# EAGLE design LaserPointerRemote (EAGLE 6.5.0)
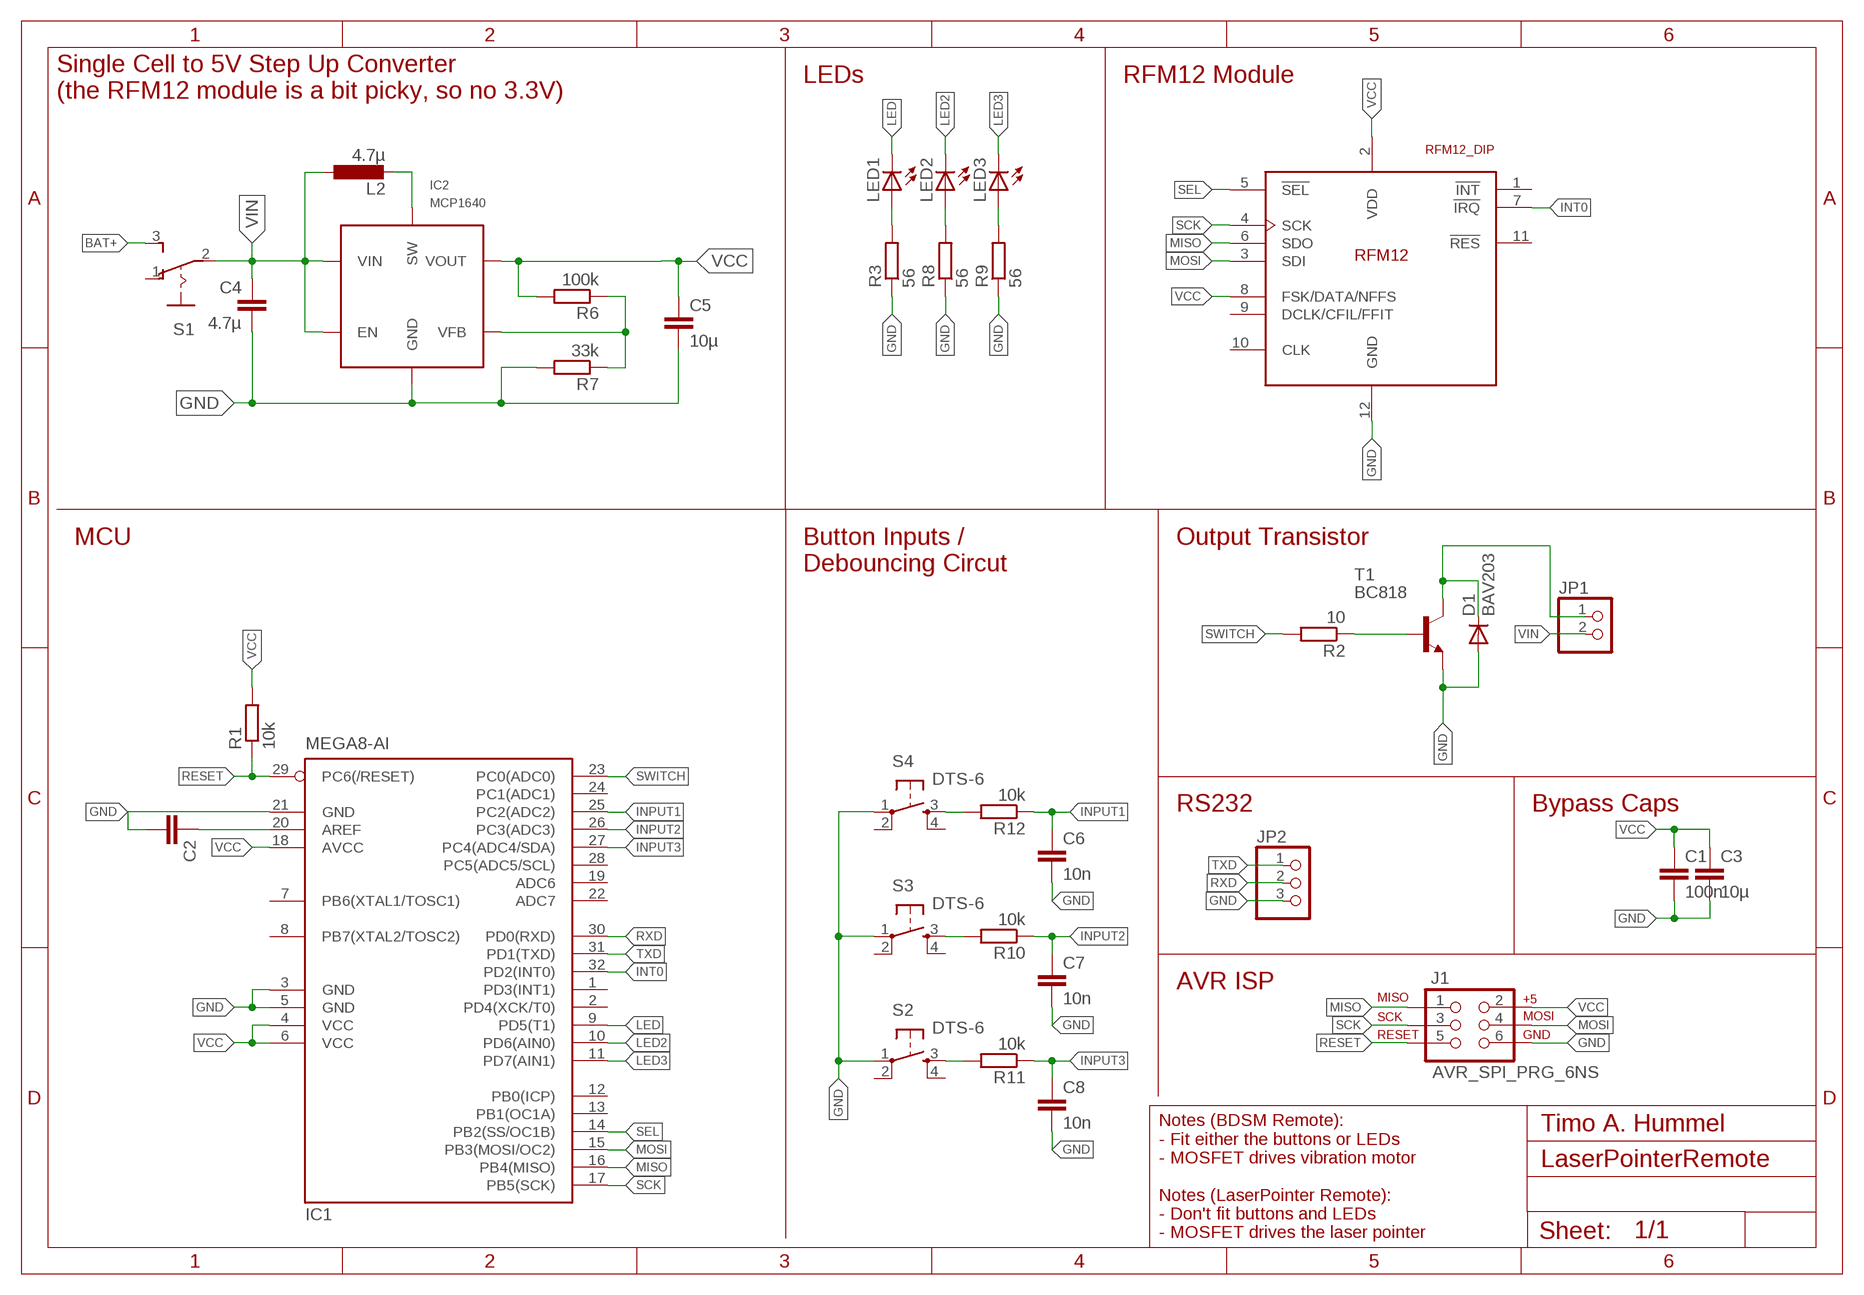
[diagram p0: schematic, sheet 1]

## Parts
C1  100n  C-EUC0805  [C0805]
C2  C-EUC0805  [C0805]
C3  10µ  C-EUC0805  [C0805]
C4  4.7µ  C-EUC0805  [C0805]
C5  10µ  C-EUC0805  [C0805]
C6  10n  C-EUC0805  [C0805]
C7  10n  C-EUC0805  [C0805]
C8  10n  C-EUC0805  [C0805]
D1  BAV203  DIODE-SOD80C  [SOD80C]
IC1  MEGA8-AI  [TQFP32-08]
IC2  MCP1640  [SOT23-6]
J1  AVR_SPI_PRG_6NS  [2X3-NS]
JP1  PINHD-1X2  [1X02]
JP2  PINHD-1X3  [1X03]
L2  4.7µ  L-EUPISG  [PISG]
LED1  LED3MM  [LED3MM]
LED2  LED3MM  [LED3MM]
LED3  LED3MM  [LED3MM]
R1  10k  R-EU_R0805  [R0805]
R2  10  R-EU_R0805  [R0805]
R3  56  R-EU_R0805  [R0805]
R6  100k  R-EU_R0805  [R0805]
R7  33k  R-EU_R0805  [R0805]
R8  56  R-EU_R0805  [R0805]
R9  56  R-EU_R0805  [R0805]
R10  10k  R-EU_R0805  [R0805]
R11  10k  R-EU_R0805  [R0805]
R12  10k  R-EU_R0805  [R0805]
S1  SS12  [NKKSS-12]
S2  DTS-6  [DTS-6]
S3  DTS-6  [DTS-6]
S4  DTS-6  [DTS-6]
T1  BC818  BC818-16-NPN-SOT23-BEC  [SOT23-BEC]
U$1  RFM12_DIP  [DIL-2MM-2X06]

## Nets
BAT+: S1.3(S)
GND: C1.2 C2.2 C3.2 C4.2 C5.2 C6.2 C7.2 C8.2 D1.A IC1.3(GND) IC1.5(GND) IC1.21(GND) IC2.2(GND) J1.6 JP2.3 R3.1 R7.2 R8.1 R9.1 S2.1 S3.1 S4.1 T1.E U$1.12(GND)
INPUT1: C6.1 IC1.25(PC2(ADC2)) R12.1
INPUT2: C7.1 IC1.26(PC3(ADC3)) R10.1
INPUT3: C8.1 IC1.27(PC4(ADC4/SDA)) R11.1
INT0: IC1.32(PD2(INT0)) U$1.7(!IRQ)
LED: IC1.9(PD5(T1)) LED1.K(C)
LED2: IC1.10(PD6(AIN0)) LED2.K(C)
LED3: IC1.11(PD7(AIN1)) LED3.K(C)
MISO: IC1.16(PB4(MISO)) J1.1 U$1.6(SDO)
MOSI: IC1.15(PB3(MOSI/OC2)) J1.4 U$1.3(SDI)
N$1: R2.1 T1.B
N$2: D1.C JP1.1 T1.C
N$3: LED1.A R3.2
N$4: C2.1 IC1.20(AREF)
N$5: LED2.A R8.2
N$6: IC2.1(SW) L2.2
N$7: LED3.A R9.2
N$8: R12.2 S4.3
N$9: IC2.4(VFB) R6.1 R7.1
N$10: R10.2 S3.3
N$11: R11.2 S2.3
RESET: IC1.29(PC6(/RESET)) J1.5 R1.1
RXD: IC1.30(PD0(RXD)) JP2.2
SCK: IC1.17(PB5(SCK)) J1.3 U$1.4(SCK)
SEL: IC1.14(PB2(SS/OC1B)) U$1.5(!SEL)
SWITCH: IC1.23(PC0(ADC0)) R2.2
TXD: IC1.31(PD1(TXD)) JP2.1
VCC: C1.1 C3.1 C5.1 IC1.4(VCC) IC1.6(VCC) IC1.18(AVCC) IC2.5(VOUT) J1.2 R1.2 R6.2 U$1.2(VDD) U$1.8(FSK/DATA/NFFS)
VIN: C4.1 IC2.3(EN) IC2.6(VIN) JP1.2 L2.1 S1.2(P)
Unconnected: IC1.1(PD3(INT1)) IC1.2(PD4(XCK/T0)) IC1.7(PB6(XTAL1/TOSC1)) IC1.8(PB7(XTAL2/TOSC2)) IC1.12(PB0(ICP)) IC1.13(PB1(OC1A)) IC1.19(ADC6) IC1.22(ADC7) IC1.24(PC1(ADC1)) IC1.28(PC5(ADC5/SCL)) S1.1(O) S2.2 S2.4 S3.2 S3.4 S4.2 S4.4 U$1.1(!INT) U$1.9(DCLK/CFIL/FFIT) U$1.10(CLK) U$1.11(!RES)

## Notes on the sheet
- Single Cell to 5V Step Up Converter
  (the RFM12 module is a bit picky, so no 3.3V)
- LEDs | RFM12 Module
- Button Inputs /
  Debouncing Circut
- MCU | Output Transistor
- RS232 | Bypass Caps
- AVR ISP
- Timo A. Hummel
- Notes (BDSM Remote):
  - Fit either the buttons or LEDs
  - MOSFET drives vibration motor
  
  Notes (LaserPointer Remote):
  - Don't fit buttons and LEDs
  - MOSFET drives the laser pointer

## Library data of the parts
C1-C3 C5-C8 = rcl:C-EU: CAPACITOR, European symbol
C4 = rcl:C-EU: CAPACITOR, European symbol; OC_TME: CL21F475ZPFNNNE
D1 = diode:DIODE-: DIODE
IC1 = atmel:MEGA8: MICROCONTROLLER 8 Kbytes FLASH, 1 kbytes SRAM, 512 bytes EEPROM, USART, 6-channel 10 bit ADC, 2-channel 8 bit ADC Pin compatible with Atmega48, ATMega88, ATMega168 Source: avr.lbr; MPN: ATMEGA8-16AU; OC_FARNELL: 9171371; OC_NEWARK: 73M8863
IC2 = SteveMarple:MCP1640: MCP1640 0.65V Start-up Synchronous Boost Regulator with True Output Disconnect or Input/Output Bypass Option; OC_TME: MCP1640CT-I/CHY
J1 = SparkFun:AVR_SPI_PRG_6: AVR ISP 6 Pin This is the reduced ISP connector for AVR programming. Common on Arduino. This footprint will take up less PCB space and can be used with a 10-pin to 6-pin adapter such as SKU: BOB-08508
JP1 = pinhead:PINHD-1X2: PIN HEADER
JP2 = pinhead:PINHD-1X3: PIN HEADER
L2 = Inductor-Fastron:L-EU; OC_TME: DL16-4.7
LED1-LED3 = led:LED: LED OSRAM: - CHIPLED LG R971, LG N971, LY N971, LG Q971, LY Q971, LO R971, LY R971 LH N974, LH R974 LS Q976, LO Q976, LY Q976 LO Q996 - Hyper CHIPLED LW Q18S LB Q993, LB Q99A, LB R99A - SideLED LS A670, LO A670, LY A670, LG A670, LP A670 LB A673, LV A673, LT A673, LW A673 LH A674 LY A675 LS A676, LA A676, LO A676, LY A676, LW A676 LS A679, LY A679, LG A679 - Hyper Micro SIDELED® LS Y876, LA Y876, LO Y876, LY Y876 LT Y87S - SmartLED LW L88C, LW L88S LB L89C, LB L89S, LG L890 LS L89K, LO L89K, LY L89K LS L896, LA L896, LO L896, LY L896 - TOPLED LS T670, LO T670, LY T670, LG T670, LP T670 LSG T670, LSP T670, LSY T670, LOP T670, LYG T670 LG T671, LOG T671, LSG T671 LB T673, LV T673, LT T673, LW T673 LH T674 LS T676, LA T676, LO T676, LY T676, LB T676, LH T676, LSB T676, LW T676 LB T67C, LV T67C, LT T67C, LS T67K, LO T67K, LY T67K, LW E67C LS E67B, LA E67B, LO E67B, LY E67B, LB E67C, LV E67C, LT E67C LW T67C LS T679, LY T679, LG T679 LS T770, LO T770, LY T770, LG T770, LP T770 LB T773, LV T773, LT T773, LW T773 LH T774 LS E675, LA E675, LY E675, LS T675 LS T776, LA T776, LO T776, LY T776, LB T776 LHGB T686 LT T68C, LB T68C - Hyper Mini TOPLED® LB M676 - Mini TOPLED Santana® LG M470 LS M47K, LO M47K, LY M47K Source: http://www.osram.convergy.de LUXEON: - LUMILED® LXK2-PW12-R00, LXK2-PW12-S00, LXK2-PW14-U00, LXK2-PW14-V00 LXK2-PM12-R00, LXK2-PM12-S00, LXK2-PM14-U00 LXK2-PE12-Q00, LXK2-PE12-R00, LXK2-PE12-S00, LXK2-PE14-T00, LXK2-PE14-U00 LXK2-PB12-K00, LXK2-PB12-L00, LXK2-PB12-M00, LXK2-PB14-N00, LXK2-PB14-P00, LXK2-PB14-Q00 LXK2-PR12-L00, LXK2-PR12-M00, LXK2-PR14-Q00, LXK2-PR14-R00 LXK2-PD12-Q00, LXK2-PD12-R00, LXK2-PD12-S00 LXK2-PH12-R00, LXK2-PH12-S00 LXK2-PL12-P00, LXK2-PL12-Q00, LXK2-PL12-R00 Source: www.luxeon.com KINGBRIGHT: KA-3528ASYC Source: www.kingbright.com
R1-R3 R8-R12 = rcl:R-EU_: RESISTOR, European symbol
R6 = rcl:R-EU_: RESISTOR, European symbol; OC_TME: CRCW080597K6FKTABC
R7 = rcl:R-EU_: RESISTOR, European symbol; OC_TME: CRCW080556K2FKTABC
S1 = SS12:SS12: SLIDING SWITCH Mors, distributor Buerklin, 11G702
S2-S4 = switch-tact:DTS-6
T1 = transistor:*-NPN-: NPN Transistror BF959 corrected 2008.03.06
U$1 = rfm_12:RFM12_DIP: RFM12 is a low costing ISM band transceiver module implemented with unique PLL. It works signal ranges from 315/433/868/915MHZ bands, comply with FCC, ETSI regulation. The SPI interface is used to communicate with microcontroller for parameter setting.

## Board
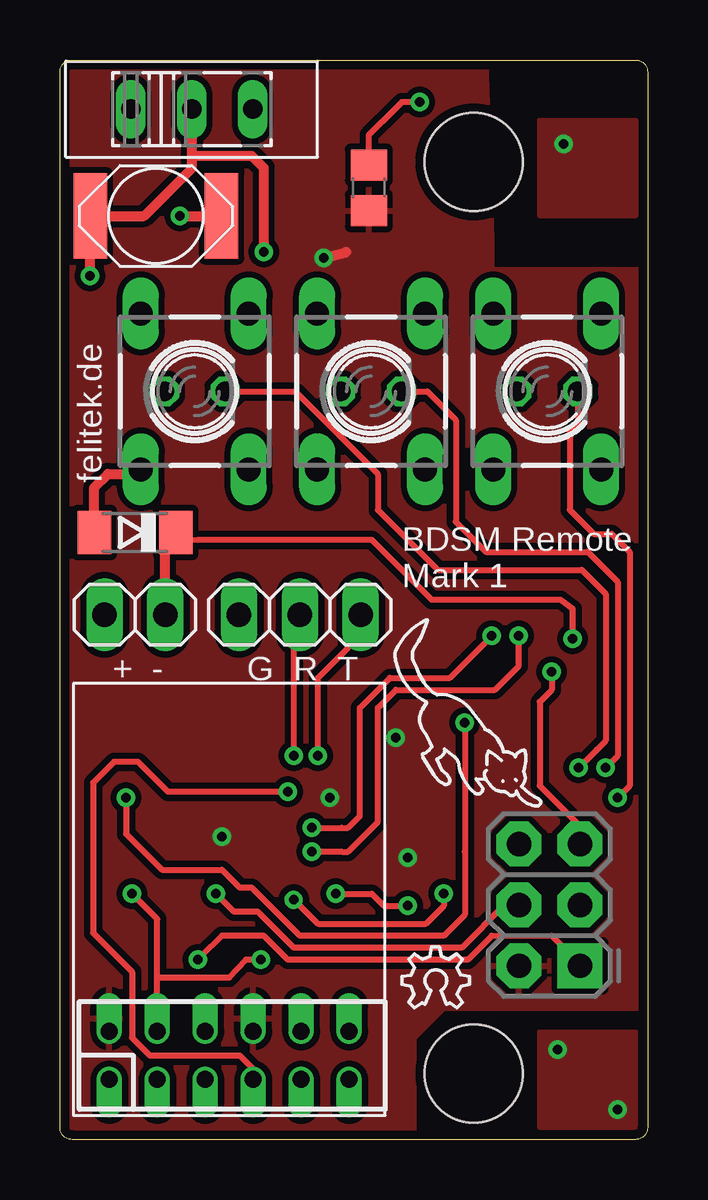
[diagram p1: board, top side]
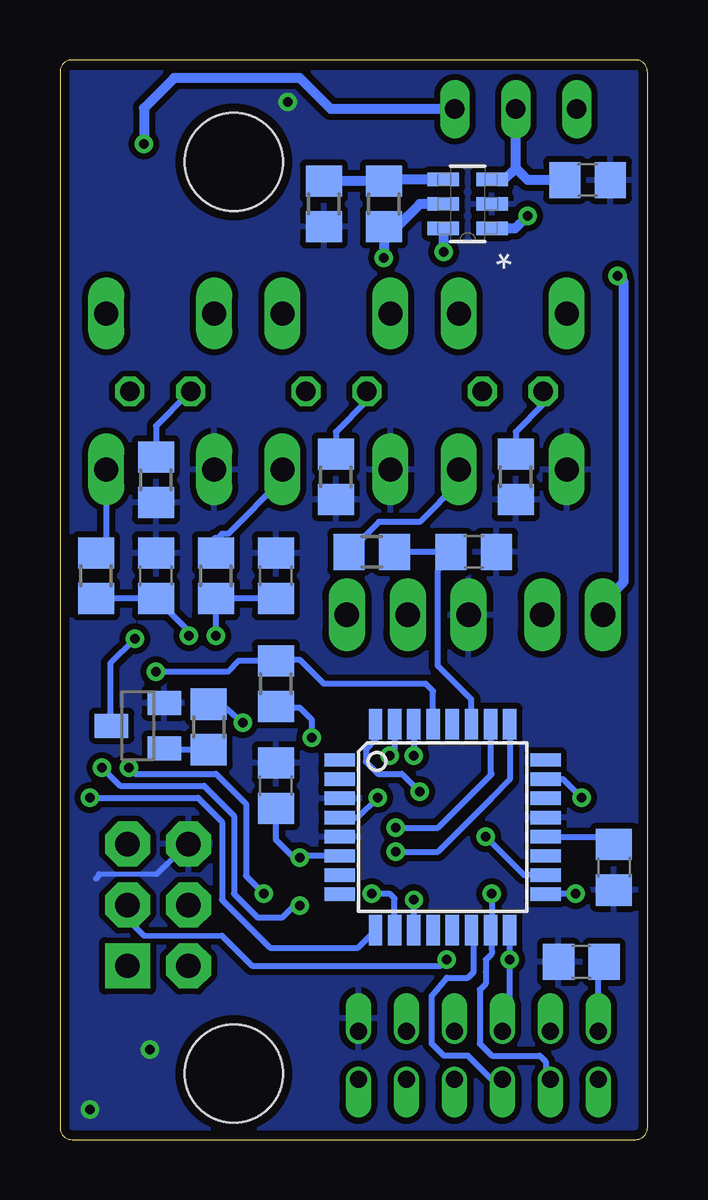
[diagram p2: board, bottom side, seen from below]

Size 24.5 x 45 mm. Coordinates in mm from the lower left corner, seen from the top.
Outline: 0.5,0 arc-90 0,0.5 0,44.5 arc-90 0.5,45 24,45 arc-90 24.5,44.5 24.5,0.5 arc-90 24,0 0.5,0
Copper layers (1*16): Top 0.0356mm / dielectric 1.5011mm / Bottom 0.0356mm
Design rules "LaenPCBOrder": minimum track width 6mil, minimum drill 13mil, track to track 6mil, track to pad 6mil, pad to pad 6mil, via to via 6mil, smd to smd 6mil, copper to edge 15mil, drill to drill 6mil, minimum pad ring 7mil, minimum via ring 7mil, stop-mask expansion 3mil, vias tented up to drill 0mil, thermal gap 10mil
Holes 4.1 mm at 17.25,40.75 17.25,2.75

### Footprints (pad centres in the part's own frame; a part is rotated, then mirrored left to right if it is on the bottom)
C0805 = smd 1.3 x 1.5: 1 -0.95,0; 2 0.95,0
SOD80C = smd 1.4 x 1.8: A 1.7,0; C -1.7,0
TQFP32-08 = smd 1.27 x 0.559: 1 -4.293,2.8; 2 -4.293,2; 3 -4.293,1.2; 4 -4.293,0.4; 5 -4.293,-0.4; 6 -4.293,-1.2; 7 -4.293,-2; 8 -4.293,-2.8; 17 4.293,-2.8; 18 4.293,-2; 19 4.293,-1.2; 20 4.293,-0.4; 21 4.293,0.4; 22 4.293,1.2; 23 4.293,2; 24 4.293,2.8 | smd 0.559 x 1.27: 9 -2.8,-4.293; 10 -2,-4.293; 11 -1.2,-4.293; 12 -0.4,-4.293; 13 0.4,-4.293; 14 1.2,-4.293; 15 2,-4.293; 16 2.8,-4.293; 25 2.8,4.293; 26 2,4.293; 27 1.2,4.293; 28 0.4,4.293; 29 -0.4,4.293; 30 -1.2,4.293; 31 -2,4.293; 32 -2.8,4.293
SOT23-6 = smd 1.321 x 0.559: 1 -1.016,1.016; 2 -1.016,0; 3 -1.016,-1.016; 4 1.016,-1.016; 5 1.016,0; 6 1.016,1.016
2X3-NS = drill 1.016 pad 1.88 square: 1 -2.54,-1.27 | drill 1.016 pad 1.88 octagon: 2 -2.54,1.27; 3 0,-1.27; 4 0,1.27; 5 2.54,-1.27; 6 2.54,1.27
1X02 = drill 1.016 long: 1 -1.27,0; 2 1.27,0
1X03 = drill 1.016 long: 1 -2.54,0; 2 0,0; 3 2.54,0
PISG = smd 1.4 x 3.56: 1 -2.73,0; 2 2.73,0
LED3MM = drill 0.813 octagon: A -1.27,0; K 1.27,0
R0805 = smd 1.3 x 1.5: 1 -0.95,0; 2 0.95,0
NKKSS-12 = drill 0.813 long: 1 -2.54,0; 2 0,0; 3 2.54,0
DTS-6 = drill 1 long: 1 -3.25,2.25; 2 3.25,2.25; 3 -3.25,-2.25; 4 3.25,-2.25
SOT23-BEC = smd 1 x 1.4: B -0.95,-1.1; C 0,1.1; E 0.95,-1.1
DIL-2MM-2X06 = drill 0.711 offset: 1 -1,5; 2 1,5; 3 -1,3; 4 1,3; 5 -1,1; 6 1,1; 7 -1,-1; 8 1,-1; 9 -1,-3; 10 1,-3; 11 -1,-5; 12 1,-5

### Placement (x,y rotation side)
C1  15.5,14.75 90 bottom
C2  1.4,11.35 270 bottom
C3  2.76,7.41 180 bottom
C4  2.5,40 0 bottom
C5  12.88,39.67 90 top
C6  20.5,23.5 90 bottom
C7  15.5,23.5 90 bottom
C8  7.25,24.5 0 bottom
D1  3.13,25.3 180 top
IC1  8.54,13.02 0 bottom
IC2  7.5,39 180 bottom
J1  20.41,9.78 90 top
JP1  3.12,21.88 180 top
JP2  10,21.88 180 top
L2  4,38.5 0 top
LED1  20.32,31.18 0 top
LED2  12.97,31.18 0 top
LED3  5.62,31.18 0 top
R1  15.5,19 270 bottom
R2  18.3,17.2 90 bottom
R3  20.5,27.5 90 bottom
R6  11,39 270 bottom
R7  13.5,39 270 bottom
R8  13,27.62 90 bottom
R9  5.5,27.62 90 bottom
R10  18,23.5 90 bottom
R11  11.5,24.5 180 bottom
R12  23,23.5 90 bottom
S1  5.5,42.95 0 top
S2  5.62,31.18 90 top
S3  12.97,31.18 90 top
S4  20.32,31.18 90 top
T1  21.25,17.25 90 bottom
U$1  7.05,3.51 90 top
U$2  [OSHW_6X100_NOTEXT]  14.25,5.5 0 top

### Tracks (layer width: path | path; a pad name or v marks a point on that pad's centre or on a via)
BAT+  (via drill 0.4)
  Bottom 0.406: S1.3 13.2,42.95 14.5,44.25 19.75,44.25 21,43 v21,41.5
  pour Top: 20,42.5 24,42.5 24,38.5 20,38.5
GND  (via drill 0.4)
  Top 0.254: C5.2 12.88,41.88 14,43 14.25,43.25 v15,43.25
  Top 0.406: D1.A 1.43,25.82 1.43,27.18 2,27.75 3.31,27.75 S2.1
  Bottom 0.203: 20.5,11.06 22.88,11.06
  Bottom 0.254: J1.6 19.18,12.32 20.5,11.06 | 22.88,11.06 23,10.88
  other vias: 20.75,3.75 23.25,1.25
  pour Bottom (isolate 0.254): 0,-1.5 25,-1.5 25,44.5 0,44.5
  pour Top (isolate 0.406, rank 2): 20,4.5 24,4.5 24,0.5 20,0.5
INPUT1  (via drill 0.4)
  Top 0.254: v10.5,12 11.75,12 12,12 13.25,13.25 13.25,18 14,18.75 18.12,18.75 19.12,19.75 v19.12,21
  Bottom 0.254: R12.1 C6.1 19.12,21.18 v19.12,21 | IC1.25 5.75,15.01 6.5,14.25 8.75,12 v10.5,12
INPUT2  (via drill 0.4)
  Top 0.254: v10.5,13 11.75,13 12,13 12.5,13.5 12.5,18 13.75,19.25 16.25,19.25 v18,21
  Bottom 0.254: C7.1 R10.1 v18,21 | IC1.26 6.54,15.71 6.54,15.29 6.5,15.25 7.25,14.5 8.75,13 v10.5,13
INPUT3
  Bottom 0.254: R11.1 C8.1 8.75,23.7 8.75,19.75 7.34,18.34 IC1.27
INT0  (via drill 0.4)
  Top 0.254: v9.5,14.5 4.5,14.5 3.25,15.75 2.25,15.75 1.38,14.88 1.38,8.62 3,7 3,4.25 3.75,3.5 7.5,3.5 8.05,2.95 U$1.7
  Bottom 0.254: IC1.32 11.35,16.66 11.75,16.25 11.75,15.75 11.25,15.25 10.25,15.25 v9.5,14.5
LED  (via drill 0.4)
  Top 0.254: LED1.K 21.59,29.84 21.25,29.5 21.25,26.25 22.25,25.25 23,25.25 23.75,24.5 23.75,14.75 v23.25,14.25
  Bottom 0.254: v23.25,14.25 18.75,14.25 17.75,13.25 17.75,10 15.75,8 12.07,8 IC1.9
LED2  (via drill 0.4)
  Top 0.254: LED2.K 15.31,31.18 16.5,30 16.5,25.75 17.5,24.75 17.75,24.5 22,24.5 23.25,23.25 23.25,16 v22.75,15.5 | v11.5,10.25 13,10.25 13.5,9.75 v14.5,9.75
  Bottom 0.254: v22.75,15.5 22,14.75 18.5,14.75 17.25,13.5 17.25,10.25 16.5,9.5 16.25,9.25 15.25,9.25 14.75,9.75 v14.5,9.75 | IC1.10 10.54,10.04 10.75,10.25 v11.5,10.25
LED3  (via drill 0.4)
  Top 0.254: LED3.K 9.81,31.18 13.25,27.75 13.25,26.25 15.75,23.75 21.75,23.75 22.75,22.75 22.75,16.62 22.38,16.25 v21.62,15.5 | v9.74,9.99 9.74,10.01 10.75,9 15.25,9 16,9.75 v16,10.25
  Bottom 0.254: v21.62,15.5 21.38,15.25 18,15.25 16.75,14 16.75,11 v16,10.25 | IC1.11 v9.74,9.99 v9.75,10
MISO  (via drill 0.4)
  Top 0.229: 20.5,8.5 18,8.5
  Top 0.254: J1.1 21.68,7.32 20.5,8.5 | 18,8.5 17,7.5 9.5,7.5 8.5,8.5 6.75,8.5 5.87,7.63 | 5.87,7.63 v5.75,7.5 5.87,7.63
  Bottom 0.254: IC1.16 v5.75,7.5 5.75,7.25 5.75,4.82 U$1.6 5.75,4.81
MOSI  (via drill 0.4)
  Top 0.254: v6.5,10.25 6.97,9.78 7.25,9.5 8.25,9.5 9.75,8 16.75,8 18.53,9.78 J1.4
  Bottom 0.254: U$1.3 4.25,2.71 4.25,3.25 4.5,3.5 6.5,3.5 7,4 7,6.25 6.75,6.5 6.75,7 6.75,7.5 6.5,7.75 IC1.15 6.5,8.77 v6.5,10.25
N$1
  Bottom 0.254: R2.1 20.19,16.25 20.19,16.26 T1.B
N$2  (via drill 0.4)
  Top 0.254: v21.38,20.88 21.38,22.12 20.88,22.5 15.5,22.5 13,25 5.75,25 4.83,25.05 D1.C 4.52,25
  Top 0.406: JP1.1 4.39,24.87 D1.C
  Bottom 0.254: v21.38,20.88 22.4,19.85 22.4,17.3 T1.C
N$3
  Bottom 0.254: LED1.A 19.19,31.06 20.5,29.75 R3.2
N$4
  Bottom 0.254: IC1.20 1.52,12.62 C2.1
N$5
  Bottom 0.254: LED2.A 11.7,30.8 13,29.5 R8.2
N$6  (via drill 0.4)
  Top 0.406: v5,38.5 L2.2
  Bottom 0.406: IC2.1 5.52,37.98 v5,38.5
N$7
  Bottom 0.254: LED3.A 4.35,30.65 5.5,29.5 R9.2
N$8
  Bottom 0.254: S4.3 22.57,24.88
  Bottom 0.406: 22.57,24.88 R12.2
N$9
  Bottom 0.406: IC2.4 10.93,40.02 R6.1 R7.1
N$10
  Bottom 0.254: 15.22,27.53 17.5,25.25 17.75,25.25 18,25
  Bottom 0.406: S3.3 15.22,27.53 | 18,25 R10.2
N$11
  Bottom 0.254: 7.87,27.38 9.5,25.75 11.2,25.75 R11.2
  Bottom 0.406: S2.3 7.87,27.38
RESET  (via drill 0.4)
  Top 0.254: J1.5 21.68,13.07 20.75,14 20,14.75 20,18.25 20.5,18.75 v20.5,19.5
  Bottom 0.254: IC1.29 8.95,18.7 9.25,19 13.5,19 14.5,20 15.45,20 R1.1 17.05,19.95 17.5,19.5 v20.5,19.5
RXD  (via drill 0.4)
  Top 0.254: v9.75,16 9.75,21.15 9.75,21.62 JP2.2
  Bottom 0.254: IC1.30 v9.74,16 v9.75,16
SCK  (via drill 0.4)
  Top 0.254: U$1.4 4.05,6.75 | 4.05,6.75 4.05,9.2 v3,10.25 | v8.38,7.5 7.75,7.5 7.05,6.75 4.05,6.75
  Bottom 0.229: 21.68,9.18 21,8.5 17.75,8.5
  Bottom 0.254: v3,10.25 4.22,10.25 IC1.17 | J1.3 21.68,9.18 | 17.75,8.5 16.5,7.25 8.62,7.25 v8.38,7.5
SEL
  Bottom 0.254: IC1.14 7.25,8.63 7.25,7 7.5,6.75 8.38,6.75 9,6 9,4 8.5,3.5 7.5,3.5 6.51,2.51 U$1.5
SWITCH  (via drill 0.4)
  Top 0.254: v2.75,14.25 2.75,12.75 4.25,11.25 6.75,11.25 7.5,10.5 8,10.5 10,8.5 16,8.5 16.88,9.38 16.88,12 v16.88,17.38
  Bottom 0.254: IC1.23 3.52,15.02 v2.75,14.25 | R2.2 17.77,18.15 v16.88,17.38
TXD  (via drill 0.4)
  Top 0.254: v10.75,16 10.75,19.25 12,20.5 12,20.86 12,21.34 JP2.1
  Bottom 0.254: IC1.31 10.54,16.2 v10.75,16
VCC  (via drill 0.4)
  Top 0.406: v11,36.75 11.94,37
  Bottom 0.254: U$1.2 2.05,7.16 C3.1 | IC1.6 14.18,11.82 14.43,11.82 | 14.43,11.82 v14.5,11.75 | 14.43,11.82 14.82,11.82 15.5,12.5 C1.1 | IC1.4 12.08,13.42 v11.25,14.25 | v14,16.75 14,17.5 14.5,18 15.45,18 R1.2 | IC1.18 5.15,11.02 6.25,12.12 v6.75,12.62
  Bottom 0.406: IC2.5 9.5,39 10,38.5 10.5,38 10.95,38 R6.2 v11,36.75
  pour Top (isolate 0.254, rank 3): 0,-1.5 14.75,-1.5 14.75,4.25 16,5.5 24.5,5.5 24.5,36.25 18,36.25 18,37.5 17.75,45 0,45
VIN  (via drill 0.4)
  Top 0.254: 1.25,38.48 L2.1
  Top 0.406: L2.1 3.5,38.5 5.5,40.5 5.5,41 | 5.5,41 S1.2 | v8.5,37 8.5,40.5 8,41 5.5,41 | v1.25,36 1.25,38.48
  Bottom 0.406: IC2.3 5.98,40.02 5.5,40.5 | 5.5,40.5 S1.2 | IC2.6 8.52,37.02 v8.5,37 | C4.1 5,40 5.5,40.5 | v1.25,36 1,35.75 1,23.25 1.88,22.38 JP1.2

### Text on the board
tNames: felitek.de | felitek.de | BDSM Remote / Mark 1 | + - | G R T
200bmp: /home/felicitus/Downloads/cat.bmp